# EAGLE schematic motorcontrol (EAGLE 6.1)
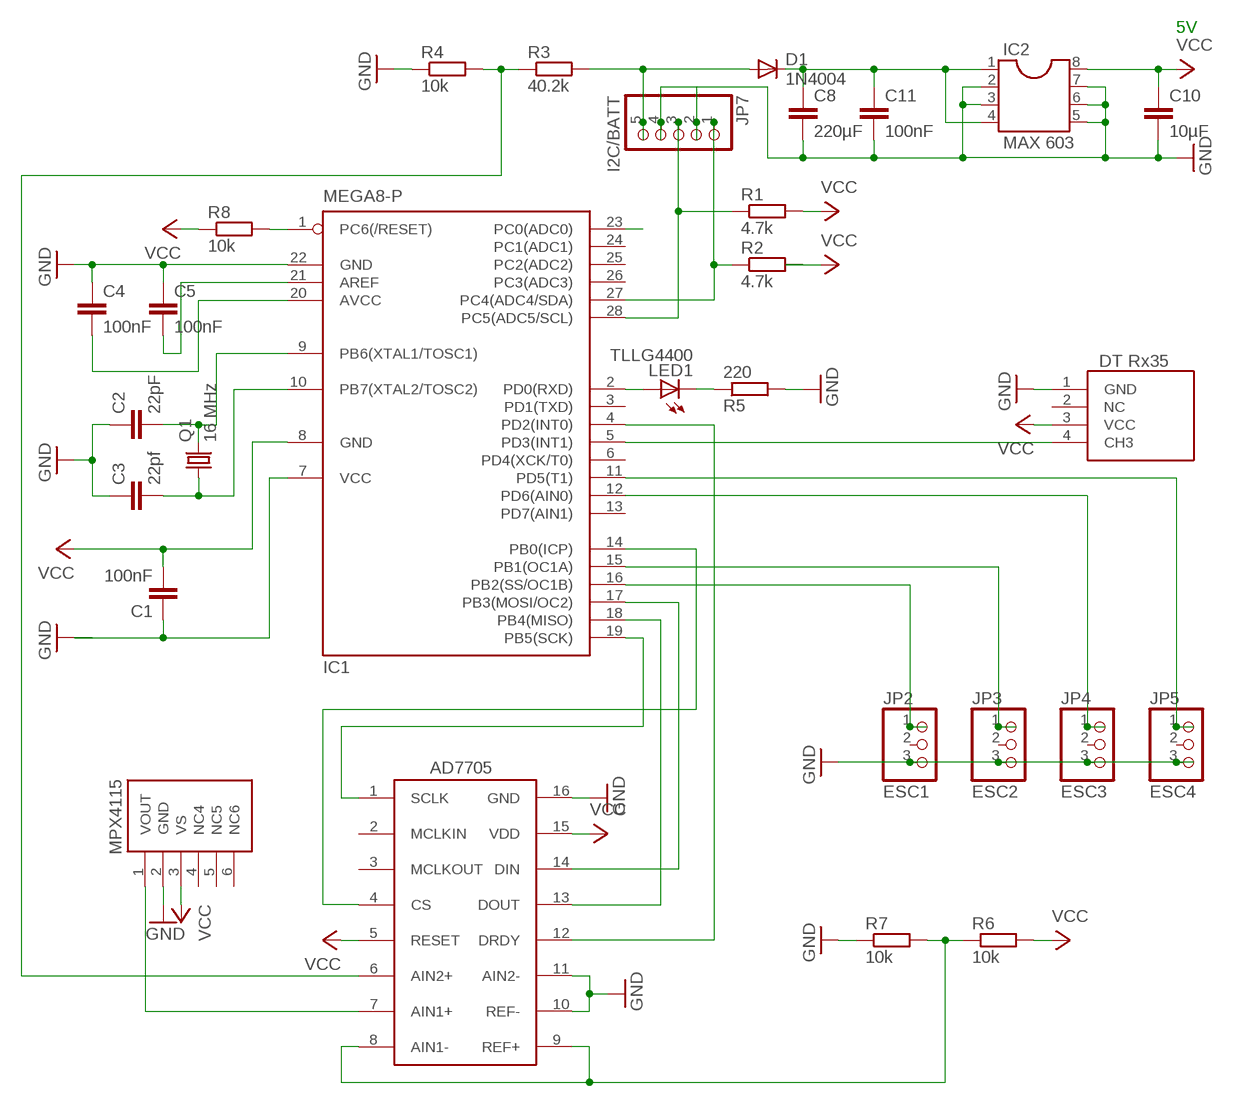
[diagram p0: schematic, sheet 1]

## Parts
C1  100nF  C2.5/2  [C2.5-2]
C2  22pF  C2.5/2  [C2.5-2]
C3  22pf  C2.5/2  [C2.5-2]
C4  100nF  C2.5/2  [C2.5-2]
C5  100nF  C2.5/2  [C2.5-2]
C8  220µF  C2.5/6  [C2.5-6]
C10  10µF  C2.5/5  [C2.5-5]
C11  100nF  C2.5/2  [C2.5-2]
D1  1N4004  [DO41-10]
IC1  MEGA8-P  [DIL28-3]
IC2  MAX 603  DIL8S  [SOCKET-08]
JP2  ESC1  PINHD-1X3/90  [1X03/90]
JP3  ESC2  PINHD-1X3/90  [1X03/90]
JP4  ESC3  PINHD-1X3/90  [1X03/90]
JP5  ESC4  PINHD-1X3/90  [1X03/90]
JP7  I2C/BATT  PINHD-1X5  [1X05]
LED1  TLLG4400  [LED3MM]
Q1  16 MHz  CRYSTALHC49S  [HC49/S]
R1  4.7k  R-EU_0207/2V  [0207/2V]
R2  4.7k  R-EU_0207/2V  [0207/2V]
R3  40.2k  R-EU_0207/2V  [0207/2V]
R4  10k  R-EU_0207/2V  [0207/2V]
R5  220  R-EU_0207/10  [0207/10]
R6  10k  R-EU_0207/2V  [0207/2V]
R7  10k  R-EU_0207/2V  [0207/2V]
R8  10k  R-EU_0207/2V  [0207/2V]
U$1  AD7705  [AD7705BNC]
U$2  DTRX35  [DTRX35]
U$3  MPX4115  [MPX4115]

## Nets
GND: C1.1 C2.1 C3.1 C4.1 C5.1 C8.2 C10.2 C11.2 IC1.7(VCC) IC1.22(GND) IC2.2 IC2.3 IC2.5 IC2.6 IC2.7 JP2.3 JP3.3 JP4.3 JP5.3 JP7.2 JP7.4 R4.1 R5.2 R7.1 U$1.10(REF-) U$1.11(AIN2-) U$1.16(GND) U$2.1(GND) U$3.2(GND)
N$1: C2.2 IC1.9(PB6(XTAL1/TOSC1)) Q1.2
N$2: C3.2 IC1.10(PB7(XTAL2/TOSC2)) Q1.1
N$3: IC1.28(PC5(ADC5/SCL)) JP7.3 R1.1
N$4: LED1.K(C) R5.1
N$5: IC1.2(PD0(RXD)) LED1.A
N$6: IC1.12(PD6(AIN0)) JP4.1
N$7: IC1.11(PD5(T1)) JP5.1
N$8: IC1.16(PB2(SS/OC1B)) JP2.1
N$9: IC1.15(PB1(OC1A)) JP3.1
N$10: C5.2 IC1.21(AREF)
N$11: C4.2 IC1.20(AVCC)
N$12: D1.A JP7.5 R3.2
N$13: R3.1 R4.2 U$1.6(AIN2+)
N$14: C8.1 C11.1 D1.C IC2.1 IC2.4
N$15: IC1.18(PB4(MISO)) U$1.13(DOUT)
N$16: IC1.17(PB3(MOSI/OC2)) U$1.14(DIN)
N$17: IC1.19(PB5(SCK)) U$1.1(SCLK)
N$18: IC1.27(PC4(ADC4/SDA)) JP7.1 R2.1
N$19: IC1.14(PB0(ICP)) U$1.4(CS)
N$20: IC1.4(PD2(INT0)) U$1.12(DRDY)
N$21: IC1.23(PC0(ADC0))
N$22: R6.1 R7.2 U$1.8(AIN1-) U$1.9(REF+)
N$23: IC1.1(PC6(/RESET)) R8.2
N$24: IC1.5(PD3(INT1)) U$2.4(CH3)
N$25: U$1.7(AIN1+) U$3.1(VOUT)
VCC: C1.2 C10.1 IC1.8(GND) IC2.8 R1.2 R2.2 R6.2 R8.1 U$1.5(RESET) U$1.15(VDD) U$2.3(VCC) U$3.3(VS)
Unconnected: IC1.3(PD1(TXD)) IC1.6(PD4(XCK/T0)) IC1.13(PD7(AIN1)) IC1.24(PC1(ADC1)) IC1.25(PC2(ADC2)) IC1.26(PC3(ADC3)) JP2.2 JP3.2 JP4.2 JP5.2 U$1.2(MCLKIN) U$1.3(MCLKOUT) U$2.2(NC) U$3.4(NC4) U$3.5(NC5) U$3.6(NC6)

## Notes on the sheet
- 5V

## Library data of the parts
C1-C5 C8 C10 C11 = capacitor-wima:C: CAPACITOR naming: grid - package width
D1 = diode:1N4004: DIODE general purpose rectifier, 1 A
IC1 = atmel:MEGA8-P: MICROCONTROLLER 8 Kbytes FLASH, 1 kbytes SRAM, 512 bytes EEPROM, USART, 4-channel 10 bit ADC, 2-channel 8 bit ADC Pin compatible with Atmega48, ATMega88, ATMega168 Source: avr.lbr; OC_FARNELL: unknown; OC_NEWARK: unknown
IC2 = ic-package:DIL8: Dual In Line / Socket
JP2-JP5 = pinhead:PINHD-1X3: PIN HEADER
JP7 = pinhead:PINHD-1X5: PIN HEADER
LED1 = led:TLLG4400: Low Current (2mA) LED 3 mm Tinted Diffused Package color GREEN Source: Data sheet <http://www.farnell.com/datasheets/391098.pdf>; MF: VISHAY SEMICONDUCTOR; OC_FARNELL: 1612435
Q1 = crystal:CRYSTAL: CRYSTAL; OC_FARNELL: 1667008; OC_NEWARK: unknown
R1-R8 = resistor:R-EU_: RESISTOR, European symbol
U$1 = ad7705:AD7705
U$2 = DTRX35:DTRX35
U$3 = MPX4115:MPX4115